# Altium schematic sheet tp1_assd.SchDoc
size A4; SheetNumber: 1; SheetTotal: 1
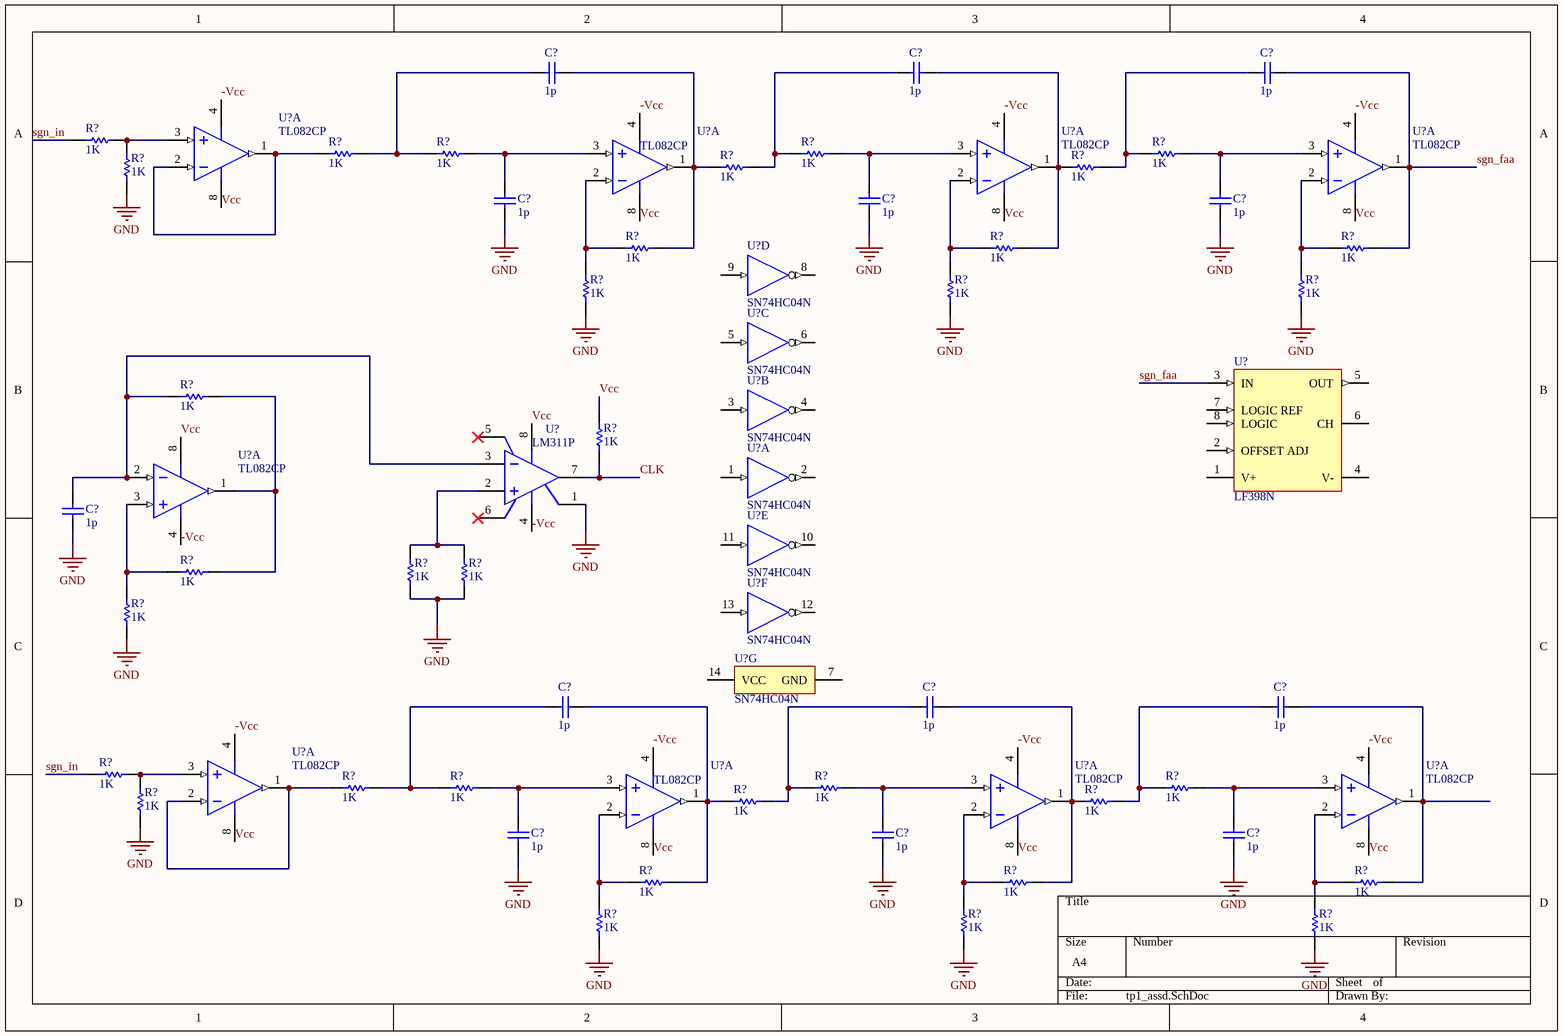
[diagram p0: tp1_assd.SchDoc]

## Parts
(Parts that share a designator on the sheet are numbered #1, #2 ... from top to bottom, then left to right.)
C?#1  value 1p  (hidden comment: Capacitor)
C?#2  value 1p  (hidden comment: Capacitor)
C?#3  value 1p  (hidden comment: Capacitor)
C?#4  value 1p  (hidden comment: Capacitor)
C?#5  value 1p  (hidden comment: Capacitor)
C?#6  value 1p  (hidden comment: Capacitor)
C?#7  value 1p  (hidden comment: Capacitor)
C?#8  value 1p  (hidden comment: Capacitor)
C?#9  value 1p  (hidden comment: Capacitor)
C?#10  value 1p  (hidden comment: Capacitor)
C?#11  value 1p  (hidden comment: Capacitor)
C?#12  value 1p  (hidden comment: Capacitor)
C?#13  value 1p  (hidden comment: Capacitor)
R?#1  value 1K  (hidden comment: Resistor)
R?#2  value 1K  (hidden comment: Resistor)
R?#3  value 1K  (hidden comment: Resistor)
R?#4  value 1K  (hidden comment: Resistor)
R?#5  value 1K  (hidden comment: Resistor)
R?#6  value 1K  (hidden comment: Resistor)
R?#7  value 1K  (hidden comment: Resistor)
R?#8  value 1K  (hidden comment: Resistor)
R?#9  value 1K  (hidden comment: Resistor)
R?#10  value 1K  (hidden comment: Resistor)
R?#11  value 1K  (hidden comment: Resistor)
R?#12  value 1K  (hidden comment: Resistor)
R?#13  value 1K  (hidden comment: Resistor)
R?#14  value 1K  (hidden comment: Resistor)
R?#15  value 1K  (hidden comment: Resistor)
R?#16  value 1K  (hidden comment: Resistor)
R?#17  value 1K  (hidden comment: Resistor)
R?#18  value 1K  (hidden comment: Resistor)
R?#19  value 1K  (hidden comment: Resistor)
R?#20  value 1K  (hidden comment: Resistor)
R?#21  value 1K  (hidden comment: Resistor)
R?#22  value 1K  (hidden comment: Resistor)
R?#23  value 1K  (hidden comment: Resistor)
R?#24  value 1K  (hidden comment: Resistor)
R?#25  value 1K  (hidden comment: Resistor)
R?#26  value 1K  (hidden comment: Resistor)
R?#27  value 1K  (hidden comment: Resistor)
R?#28  value 1K  (hidden comment: Resistor)
R?#29  value 1K  (hidden comment: Resistor)
R?#30  value 1K  (hidden comment: Resistor)
R?#31  value 1K  (hidden comment: Resistor)
R?#32  value 1K  (hidden comment: Resistor)
R?#33  value 1K  (hidden comment: Resistor)
R?#34  value 1K  (hidden comment: Resistor)
U?#1  TL082CP  [P0008A]  (part A of 2)
U?#2  TL082CP  [P0008A]  (part A of 2)
U?#3  TL082CP  [P0008A]  (part A of 2)
U?#4  TL082CP  [P0008A]  (part A of 2)
U?#5  SN74HC04N  [N0014A]  (part D of 7)
U?#6  SN74HC04N  [N0014A]  (part C of 7)
U?#7  LF398N  [N08E]
U?#8  SN74HC04N  [N0014A]  (part B of 7)
U?#9  LM311P  [FP-P0008A-MFG]
U?#10  SN74HC04N  [N0014A]  (part A of 7)
U?#11  TL082CP  [P0008A]  (part A of 2)
U?#12  SN74HC04N  [N0014A]  (part E of 7)
U?#13  SN74HC04N  [N0014A]  (part F of 7)
U?#14  SN74HC04N  [N0014A]  (part G of 7)
U?#15  TL082CP  [P0008A]  (part A of 2)
U?#16  TL082CP  [P0008A]  (part A of 2)
U?#17  TL082CP  [P0008A]  (part A of 2)
U?#18  TL082CP  [P0008A]  (part A of 2)

## Nets
GND: C?#4.1 C?#5.1 C?#6.1 C?#7.1 C?#11.1 C?#12.1 C?#13.1 R?#8.1 R?#12.1 R?#13.1 R?#14.1 R?#18.2 R?#19.1 R?#20.1 R?#28.1 R?#32.1 R?#33.1 R?#34.1 U?#9.1(EMIT_OUT)
-Vcc: U?#1.4(VCC-) U?#2.4(VCC-) U?#3.4(VCC-) U?#4.4(VCC-) U?#9.4(VCC-) U?#11.4(VCC-) U?#15.4(VCC-) U?#16.4(VCC-) U?#17.4(VCC-) U?#18.4(VCC-)
CLK: R?#16.1 U?#9.7(COL_OUT)
sgn_faa: C?#3.1 R?#11.2 U?#4.1(OUT1) U?#7.3(IN)
sgn_in: R?#1.2 R?#21.2
Vcc: R?#16.2 U?#1.8(VCC+) U?#2.8(VCC+) U?#3.8(VCC+) U?#4.8(VCC+) U?#9.8(VCC+) U?#11.8(VCC+) U?#15.8(VCC+) U?#16.8(VCC+) U?#17.8(VCC+) U?#18.8(VCC+)
NetC?#1_1: C?#1.1 R?#6.1 R?#9.2 U?#2.1(OUT1)
NetC?#1_2: C?#1.2 R?#2.2 R?#3.1
NetC?#2_1: C?#2.1 R?#7.1 R?#10.2 U?#3.1(OUT1)
NetC?#2_2: C?#2.2 R?#4.1 R?#6.2
NetC?#3_2: C?#3.2 R?#5.1 R?#7.2
NetC?#4_2: C?#4.2 R?#3.2 U?#2.3(IN1+)
NetC?#5_2: C?#5.2 R?#4.2 U?#3.3(IN1+)
NetC?#6_2: C?#6.2 R?#5.2 U?#4.3(IN1+)
NetC?#7_2: C?#7.2 R?#15.2 U?#9.3(IN-) U?#11.2(IN1-)
NetC?#8_1: C?#8.1 R?#26.1 R?#29.2 U?#16.1(OUT1)
NetC?#8_2: C?#8.2 R?#22.2 R?#23.1
NetC?#9_1: C?#9.1 R?#27.1 R?#30.2 U?#17.1(OUT1)
NetC?#9_2: C?#9.2 R?#24.1 R?#26.2
NetC?#10_1: C?#10.1 R?#31.2 U?#18.1(OUT1)
NetC?#10_2: C?#10.2 R?#25.1 R?#27.2
NetC?#11_2: C?#11.2 R?#23.2 U?#16.3(IN1+)
NetC?#12_2: C?#12.2 R?#24.2 U?#17.3(IN1+)
NetC?#13_2: C?#13.2 R?#25.2 U?#18.3(IN1+)
NetR?#1_1: R?#1.1 R?#8.2 U?#1.3(IN1+)
NetR?#2_1: R?#2.1 U?#1.1(OUT1) U?#1.2(IN1-)
NetR?#9_1: R?#9.1 R?#12.2 U?#2.2(IN1-)
NetR?#10_1: R?#10.1 R?#13.2 U?#3.2(IN1-)
NetR?#11_1: R?#11.1 R?#14.2 U?#4.2(IN1-)
NetR?#15_1: R?#15.1 R?#17.1 U?#11.1(OUT1)
NetR?#17_2: R?#17.2 R?#18.1 U?#11.3(IN1+)
NetR?#19_2: R?#19.2 R?#20.2 U?#9.2(IN+)
NetR?#21_1: R?#21.1 R?#28.2 U?#15.3(IN1+)
NetR?#22_1: R?#22.1 U?#15.1(OUT1) U?#15.2(IN1-)
NetR?#29_1: R?#29.1 R?#32.2 U?#16.2(IN1-)
NetR?#30_1: R?#30.1 R?#33.2 U?#17.2(IN1-)
NetR?#31_1: R?#31.1 R?#34.2 U?#18.2(IN1-)

Not connected (* = marked no-connect by the designer): U?#5 8(~{4Y}) 9(4A); U?#6 5(3A) 6(~{3Y}); U?#7 1(V+) 2(OFFSET_ADJ) 4(V-) 5(OUT) 6(CH) 7(LOGIC_REF) 8(LOGIC); U?#8 3(2A) 4(~{2Y}); U?#9 5(BALANCE)* 6(BAL/STRB)*; U?#10 1(1A) 2(~{1Y}); U?#12 10(~{5Y}) 11(5A); U?#13 12(~{6Y}) 13(6A); U?#14 7(GND) 14(VCC)

## Library data of the parts
C?#1-C?#13 = Capacitor: SimulationGenericComponent: True
R?#1-R?#34 = Resistor: TC1: 0; SimulationGenericComponent: True; TC2: 0
U?#1-U?#4 U?#11 U?#15-U?#18 = CMP-0055-00158-5: JFET-Input Operational Amplifier, 7 to 36 V, 0 to 70 degC, 8-pin DIP (P8), Pb-Free (RoHS); Manufacturer: Texas Instruments; Total Supply Voltage(Max)(+5V is 5, +/-5V is 10): 36; Rating: Catalog; Number of Channels: 2; Slew Rate(Typ)(V/us): 13; CMRR(Min)(dB): 70; Sub Family: General Purpose Amplifier, High Supply Voltage Amplifier (>=30V); Offset Drift(Typ)(uV/C): 18; Total Supply Voltage(Min)(+5V is 5, +/-5V is 10): 7; IIB(Max)(pA): 400; GBW(Typ)(MHz): 3; Iq per channel(Max)(mA): 2.8; Vio (25C)(Max)(mV): 15; PackageDescription: 8-Pin Plastic In-Line, Body 9.59 x 6.35 mm, Pitch 2.54 mm; ComponentLink2URL: http://www.ti.com/lit/ds/symlink/tl082.pdf; Mounting Technology: Through Hole; Code_JEDEC: MS-001; ComponentLink1Description: Manufacturer URL; ComponentLink3Description: Package Specification; PartNumber: TL082CP; PackageVersion: 4040082/E, 04/2010; Eco-Plan: Pb-Free (RoHS); ComponentLink1URL: http://www.ti.com/; PackageReference: P0008A; ComponentLink3URL: http://www.ti.com/litv/pdf/mpdi001b; DatasheetVersion: SLOS081G; ComponentLink2Description: Datasheet; Vn at 1kHz(Typ)(nV/rtHz): 18
U?#5 U?#6 U?#8 U?#10 U?#12-U?#14 = CMP-1615-00892-2: Hex Inverters, N0014A, TUBE; Manufacturer: Texas Instruments; VCC(Min)(V): 2; Bits(#): 6; Technology Family: HC; tpd @ Nom Voltage(Max)(ns): 20; Output Drive (IOL/IOH)(Max)(mA): -4/4; Rating: Catalog; Voltage(Nom)(V): 5; Schmitt Trigger: No; ICC @ Nom Voltage(Max)(mA): 0.02; Input Type: CMOS; Code_JEDEC: MS-001; PackageReference: N0014A; DatasheetVersion: SCLS078F; Output Type: CMOS; VCC(Max)(V): 6; Operating Temperature Range(C): -40 to 85; Generic Part Number: SN74HC04; F @ Nom Voltage(Max)(Mhz): 20
U?#7 = CMP-0056-00013-2: Monolithic Sample and Hold Circuits, 8-pin MDIP; Manufacturer: National Semiconductor; PowerWise: N; PackageTopMarking: NSUZXYTTE#*LF*398N; CompType: Analog IC; PackageReference: N08E; PackageVersion: revG, May-2006; Code_JEDEC: MS-001-BA; ComponentLink1URL: http://www.national.com/ds/LF/LF398.pdf; DatasheetVersion: Jul-2000; RoHS: N; ComponentLink2URL: http://www.national.com/pf/LF/LF398.html; ComponentLink2Description: LF398 Web Page; ComponentLink3URL: http://www.national.com/packaging/folders/n08e.html; ComponentLink1Description: LF398 Datasheet; RevisionNote: Component URLs added; PinCount: 8; ComponentLink3Description: N08E Package Page; PackageDescription: MDIP, .365 x .250 x .130in, 8 Lead, .100in Pitch
U?#9 = CMP-1685-00016-2: Manufacturer Lifecycle Status: ACTIVE; NexarPartId: 24336; Output Type: TTL; Max Output Voltage: 7.5mV; Min Supply Voltage: 3.5V; Min Dual Supply Voltage: 1.75V; Max Supply Current: 7.5mA; Number of Elements: 1; Response Time: 165ns; Max Dual Supply Voltage: 15V; Max Supply Voltage: 30V; Max Junction Temperature (Tj): 150°C; Max Power Dissipation: 500mW; Input Offset Voltage (Vos): 2mV; Resistance: 390Ω; Operating Supply Voltage: 28V; Power Rating: 100mW; Dual Supply Voltage: 9V; Output Current per Channel: 50mA; Turn-On Delay Time: 115ns; Tolerance: 1%; Voltage Gain: 106.02dB; Input Bias Current: 250nA; Voltage Rating: 75V; Contact Plating: Gold; Case Code (Imperial): 0603; Number of Circuits: 1; Lifecycle Status: Production; Ambient Temperature Range High: 70°C; Radiation Hardening: No; Quiescent Current: 7.5mA; Number of Channels: 1; Max Operating Temperature: 70°C; Height: 5.08mm; Type: General Purpose; Case Code (Metric): 1608; Mount: Surface Mount, Through Hole; Case/Package: PDIP; Thickness: 3.9mm; REACH SVHC: No SVHC; Length: 9.81mm; RoHS: Compliant; Schedule B: 8542390000, 8542390000; Lead Free: Lead Free; Min Operating Temperature: 0°C; Width: 6.35mm; Output Current: 50mA; Packaging: Tape and Reel; Nominal Supply Current: 7.5mA; Weight: 2.012816mg; Propagation Delay: 115ns; Max Input Current: 250nA; Number of Pins: 8